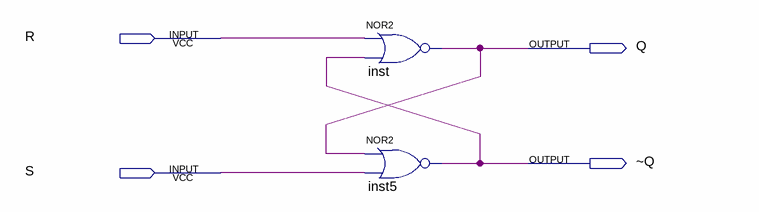
[diagram p0: schematic sheet]
// Quartus schematic SR_Latch_NOR.bdf as structural Verilog: 2 symbols, 4 pins
module SR_Latch_NOR (
  input  R,
  input  S,
  output Q,
  output \~Q 
);

  nor inst (Q, R, \~Q );
  nor inst5 (\~Q , Q, S);
endmodule
